# Altium schematic sheet config-ground.SchDoc: Config FPGA - Ground
size Letter; CheckedBy: E. Chiu; CompanyName: Brinton Engineering, LLC; DrawnBy: J. Brinton; Engineer: J. Brinton; Address1: 3479 Edison Way; Address2: Menlo Park CA 94025; Address3: +1 (877) 778-8435; Address4: brintonengineering.com; Revision: 1; SheetNumber: 26; SheetTotal: 71
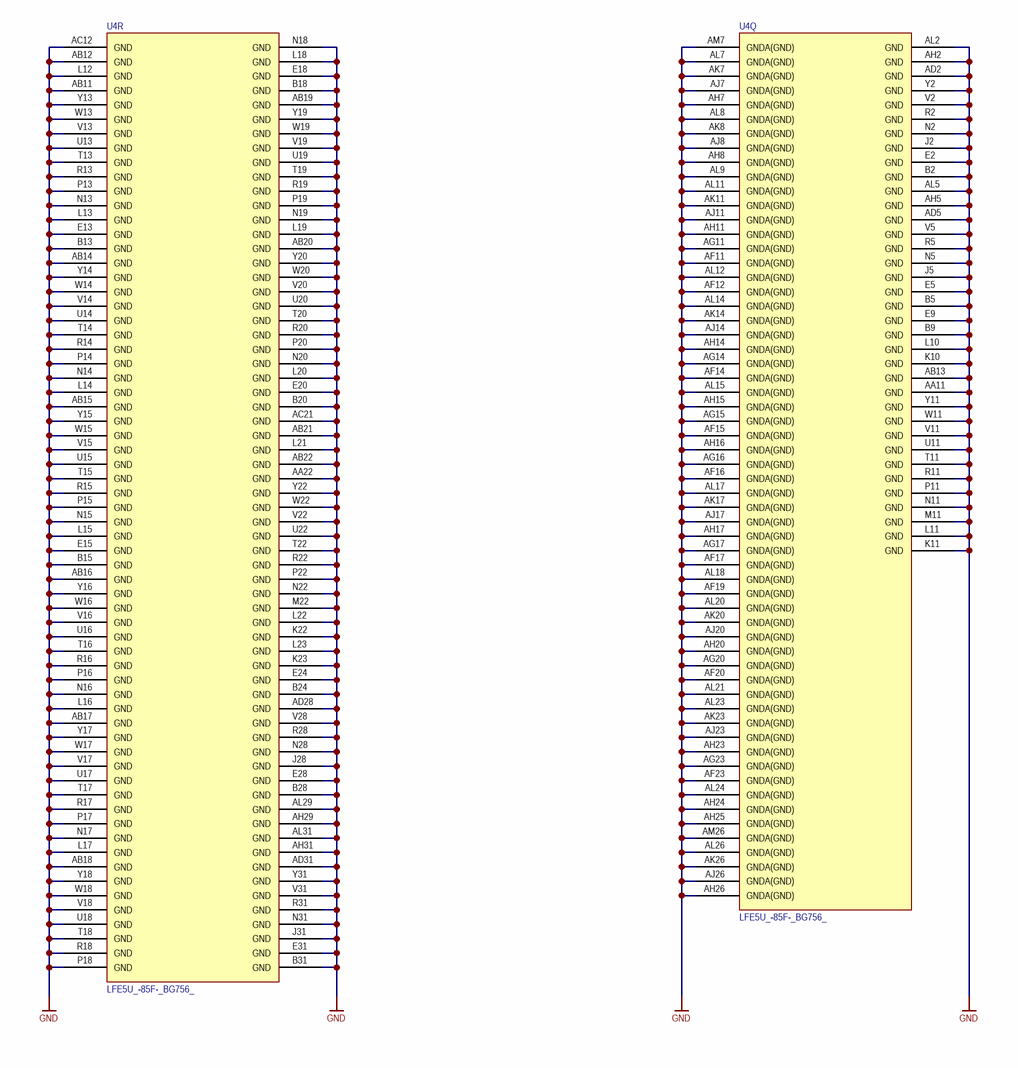
[diagram p0: config-ground.SchDoc]

## Parts
U4  LFE5U_-85F-_BG756_  [caBGA756]  (parts Q,R of 19)

## Nets
GND: U4.AA11(GND) U4.AA22(GND) U4.AB11(GND) U4.AB12(GND) U4.AB13(GND) U4.AB14(GND) U4.AB15(GND) U4.AB16(GND) U4.AB17(GND) U4.AB18(GND) U4.AB19(GND) U4.AB20(GND) U4.AB21(GND) U4.AB22(GND) U4.AC12(GND) U4.AC21(GND) U4.AD2(GND) U4.AD5(GND) U4.AD28(GND) U4.AD31(GND) U4.AF11(GNDA(GND)) U4.AF12(GNDA(GND)) U4.AF14(GNDA(GND)) U4.AF15(GNDA(GND)) U4.AF16(GNDA(GND)) U4.AF17(GNDA(GND)) U4.AF19(GNDA(GND)) U4.AF20(GNDA(GND)) U4.AF23(GNDA(GND)) U4.AG11(GNDA(GND)) U4.AG14(GNDA(GND)) U4.AG15(GNDA(GND)) U4.AG16(GNDA(GND)) U4.AG17(GNDA(GND)) U4.AG20(GNDA(GND)) U4.AG23(GNDA(GND)) U4.AH2(GND) U4.AH5(GND) U4.AH7(GNDA(GND)) U4.AH8(GNDA(GND)) U4.AH11(GNDA(GND)) U4.AH14(GNDA(GND)) U4.AH15(GNDA(GND)) U4.AH16(GNDA(GND)) U4.AH17(GNDA(GND)) U4.AH20(GNDA(GND)) U4.AH23(GNDA(GND)) U4.AH24(GNDA(GND)) U4.AH25(GNDA(GND)) U4.AH26(GNDA(GND)) U4.AH29(GND) U4.AH31(GND) U4.AJ7(GNDA(GND)) U4.AJ8(GNDA(GND)) U4.AJ11(GNDA(GND)) U4.AJ14(GNDA(GND)) U4.AJ17(GNDA(GND)) U4.AJ20(GNDA(GND)) U4.AJ23(GNDA(GND)) U4.AJ26(GNDA(GND)) U4.AK7(GNDA(GND)) U4.AK8(GNDA(GND)) U4.AK11(GNDA(GND)) U4.AK14(GNDA(GND)) U4.AK17(GNDA(GND)) U4.AK20(GNDA(GND)) U4.AK23(GNDA(GND)) U4.AK26(GNDA(GND)) U4.AL2(GND) U4.AL5(GND) U4.AL7(GNDA(GND)) U4.AL8(GNDA(GND)) U4.AL9(GNDA(GND)) U4.AL11(GNDA(GND)) U4.AL12(GNDA(GND)) U4.AL14(GNDA(GND)) U4.AL15(GNDA(GND)) U4.AL17(GNDA(GND)) U4.AL18(GNDA(GND)) U4.AL20(GNDA(GND)) U4.AL21(GNDA(GND)) U4.AL23(GNDA(GND)) U4.AL24(GNDA(GND)) U4.AL26(GNDA(GND)) U4.AL29(GND) U4.AL31(GND) U4.AM7(GNDA(GND)) U4.AM26(GNDA(GND)) U4.B2(GND) U4.B5(GND) U4.B9(GND) U4.B13(GND) U4.B15(GND) U4.B18(GND) U4.B20(GND) U4.B24(GND) U4.B28(GND) U4.B31(GND) U4.E2(GND) U4.E5(GND) U4.E9(GND) U4.E13(GND) U4.E15(GND) U4.E18(GND) U4.E20(GND) U4.E24(GND) U4.E28(GND) U4.E31(GND) U4.J2(GND) U4.J5(GND) U4.J28(GND) U4.J31(GND) U4.K10(GND) U4.K11(GND) U4.K22(GND) U4.K23(GND) U4.L10(GND) U4.L11(GND) U4.L12(GND) U4.L13(GND) U4.L14(GND) U4.L15(GND) U4.L16(GND) U4.L17(GND) U4.L18(GND) U4.L19(GND) U4.L20(GND) U4.L21(GND) U4.L22(GND) U4.L23(GND) U4.M11(GND) U4.M22(GND) U4.N2(GND) U4.N5(GND) U4.N11(GND) U4.N13(GND) U4.N14(GND) U4.N15(GND) U4.N16(GND) U4.N17(GND) U4.N18(GND) U4.N19(GND) U4.N20(GND) U4.N22(GND) U4.N28(GND) U4.N31(GND) U4.P11(GND) U4.P13(GND) U4.P14(GND) U4.P15(GND) U4.P16(GND) U4.P17(GND) U4.P18(GND) U4.P19(GND) U4.P20(GND) U4.P22(GND) U4.R2(GND) U4.R5(GND) U4.R11(GND) U4.R13(GND) U4.R14(GND) U4.R15(GND) U4.R16(GND) U4.R17(GND) U4.R18(GND) U4.R19(GND) U4.R20(GND) U4.R22(GND) U4.R28(GND) U4.R31(GND) U4.T11(GND) U4.T13(GND) U4.T14(GND) U4.T15(GND) U4.T16(GND) U4.T17(GND) U4.T18(GND) U4.T19(GND) U4.T20(GND) U4.T22(GND) U4.U11(GND) U4.U13(GND) U4.U14(GND) U4.U15(GND) U4.U16(GND) U4.U17(GND) U4.U18(GND) U4.U19(GND) U4.U20(GND) U4.U22(GND) U4.V2(GND) U4.V5(GND) U4.V11(GND) U4.V13(GND) U4.V14(GND) U4.V15(GND) U4.V16(GND) U4.V17(GND) U4.V18(GND) U4.V19(GND) U4.V20(GND) U4.V22(GND) U4.V28(GND) U4.V31(GND) U4.W11(GND) U4.W13(GND) U4.W14(GND) U4.W15(GND) U4.W16(GND) U4.W17(GND) U4.W18(GND) U4.W19(GND) U4.W20(GND) U4.W22(GND) U4.Y2(GND) U4.Y11(GND) U4.Y13(GND) U4.Y14(GND) U4.Y15(GND) U4.Y16(GND) U4.Y17(GND) U4.Y18(GND) U4.Y19(GND) U4.Y20(GND) U4.Y22(GND) U4.Y31(GND)

## Notes on the sheet
- Title
- Engineer
- Revision
- Drawn By
- Checked By
- Date
- Sheet
- of

## Library data of the parts
U4 = LFE5U_-85F-_BG756_: ECP5 FPGA, 85k LUT, 756-caBGA; Manufacturer: Lattice Semiconductor; Manufacturer P/N: LFE5U_-85F-_BG756_